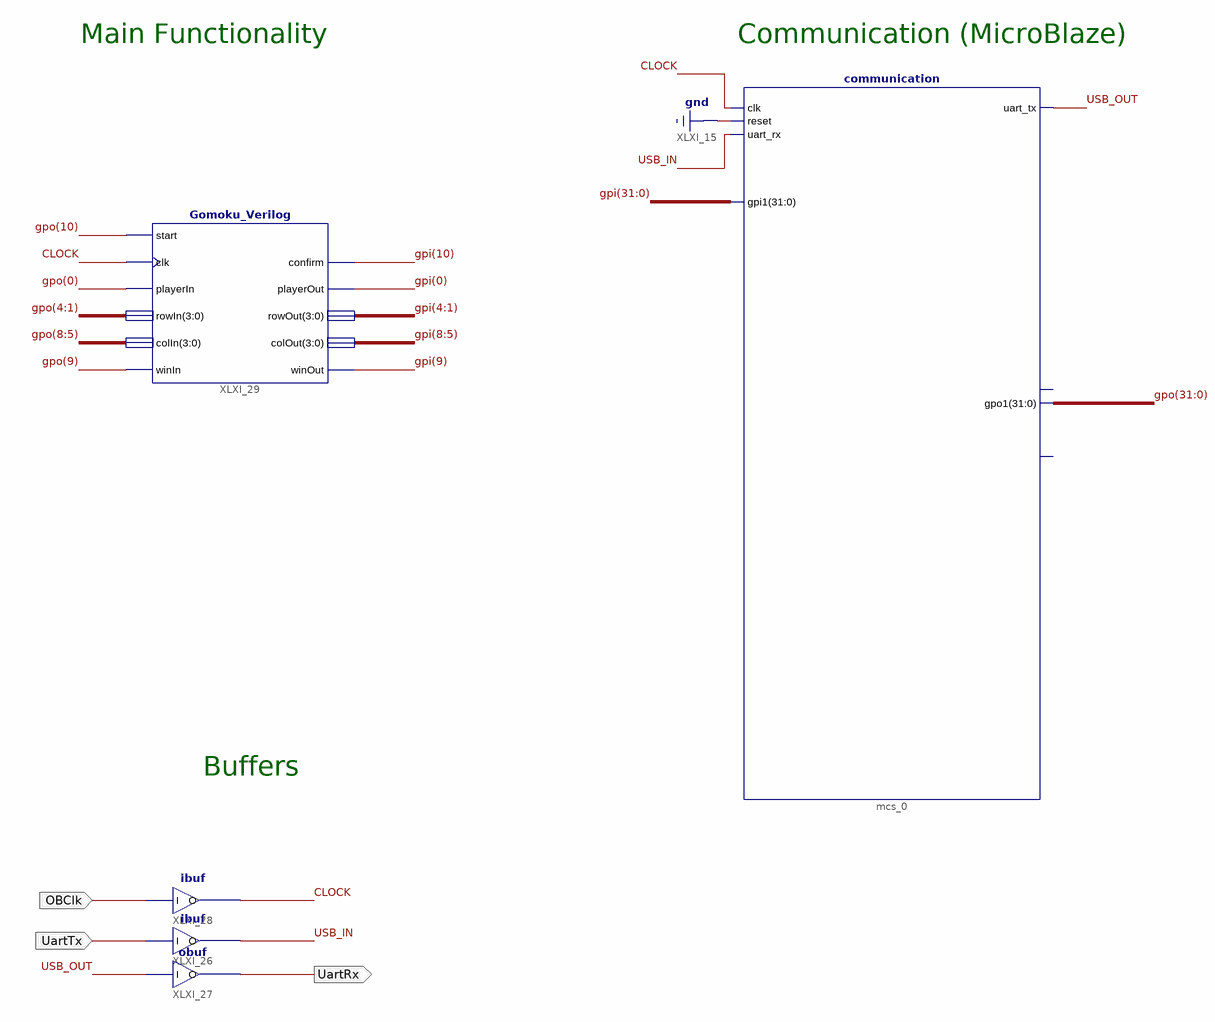
[diagram p0: schematic sheet 1]
// Xilinx ISE schematic simple.sch (artix7) as structural Verilog: 5 symbols, 3 ports
module simple (
  input  OBClk,
  input  UartTx,
  output UartRx
);

  wire CLOCK, USB_IN, USB_OUT;
  wire [31:0] gpi, gpo;

  communication mcs_0 (
    .clk(CLOCK), .reset(1'b0), .uart_tx(USB_OUT), .uart_rx(USB_IN), .gpi1(gpi), .gpo1(gpo));  // open: uart_interrupt, intc_irq
  ibuf XLXI_26 (.I(UartTx), .O(USB_IN));
  obuf XLXI_27 (.I(USB_OUT), .O(UartRx));
  ibuf XLXI_28 (.I(OBClk), .O(CLOCK));
  Gomoku_Verilog XLXI_29 (
    .playerIn(gpo[0]), .rowIn(gpo[4:1]), .colIn(gpo[8:5]), .winIn(gpo[9]), .playerOut(gpi[0]),
    .rowOut(gpi[4:1]), .colOut(gpi[8:5]), .winOut(gpi[9]), .clk(CLOCK), .start(gpo[10]), .confirm(gpi[10]));

  // Notes on the sheet:
  //   Main Functionality
  //   Communication (MicroBlaze)
  //   Buffers
endmodule
